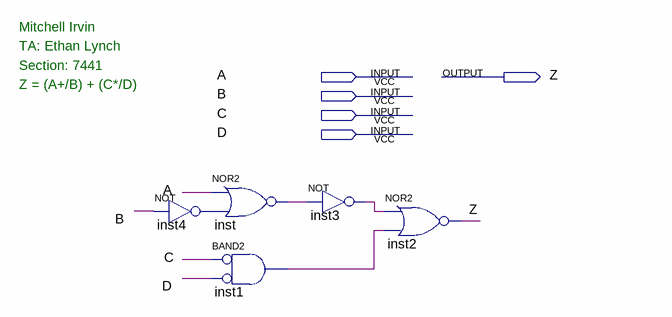
[diagram p0: schematic sheet]
// Quartus schematic lab2.bdf as structural Verilog: 5 symbols, 5 pins
module lab2 (
  input  A,
  input  B,
  input  C,
  input  D,
  output Z
);

  wire inst1_out, inst3_out, inst4_out, inst_out;

  not inst4 (inst4_out, B);
  nor inst (inst_out, A, inst4_out);
  and inst1 (inst1_out, ~C, ~D);  // BAND2
  not inst3 (inst3_out, inst_out);
  nor inst2 (Z, inst3_out, inst1_out);

  // Notes on the sheet:
  //   Mitchell Irvin
  //   TA: Ethan Lynch
  //   Section: 7441
  //   Z = (A+/B) + (C*/D)
endmodule
